# Altium project Gen_Ai_Kbd.PrjPcb (part 2 of 3)

## Sheet Lights.SchDoc
size 594 x 420 mm; SheetNumber: 4; SheetTotal: 11; SPICEModelCacheKKOZVZNQ: <root> / <DocumentId>KKOZVZNQ</DocumentId> / <CacheFrame Number="0"> / <Model Name="0402_885012205018_100nf" Kind="CKT"> / <Text>******* / .subckt 0402_885012205018_100nF 1 2 / Rser 1 3 0.0183525691398 / Lser 2 4 3.07541467E-10 / C1 3 4 0.0000001 / Rpar 3 4 5000000000 / .ends 0402_885012205018_100nF</Text> / </Model> / </CacheFrame> / </root>
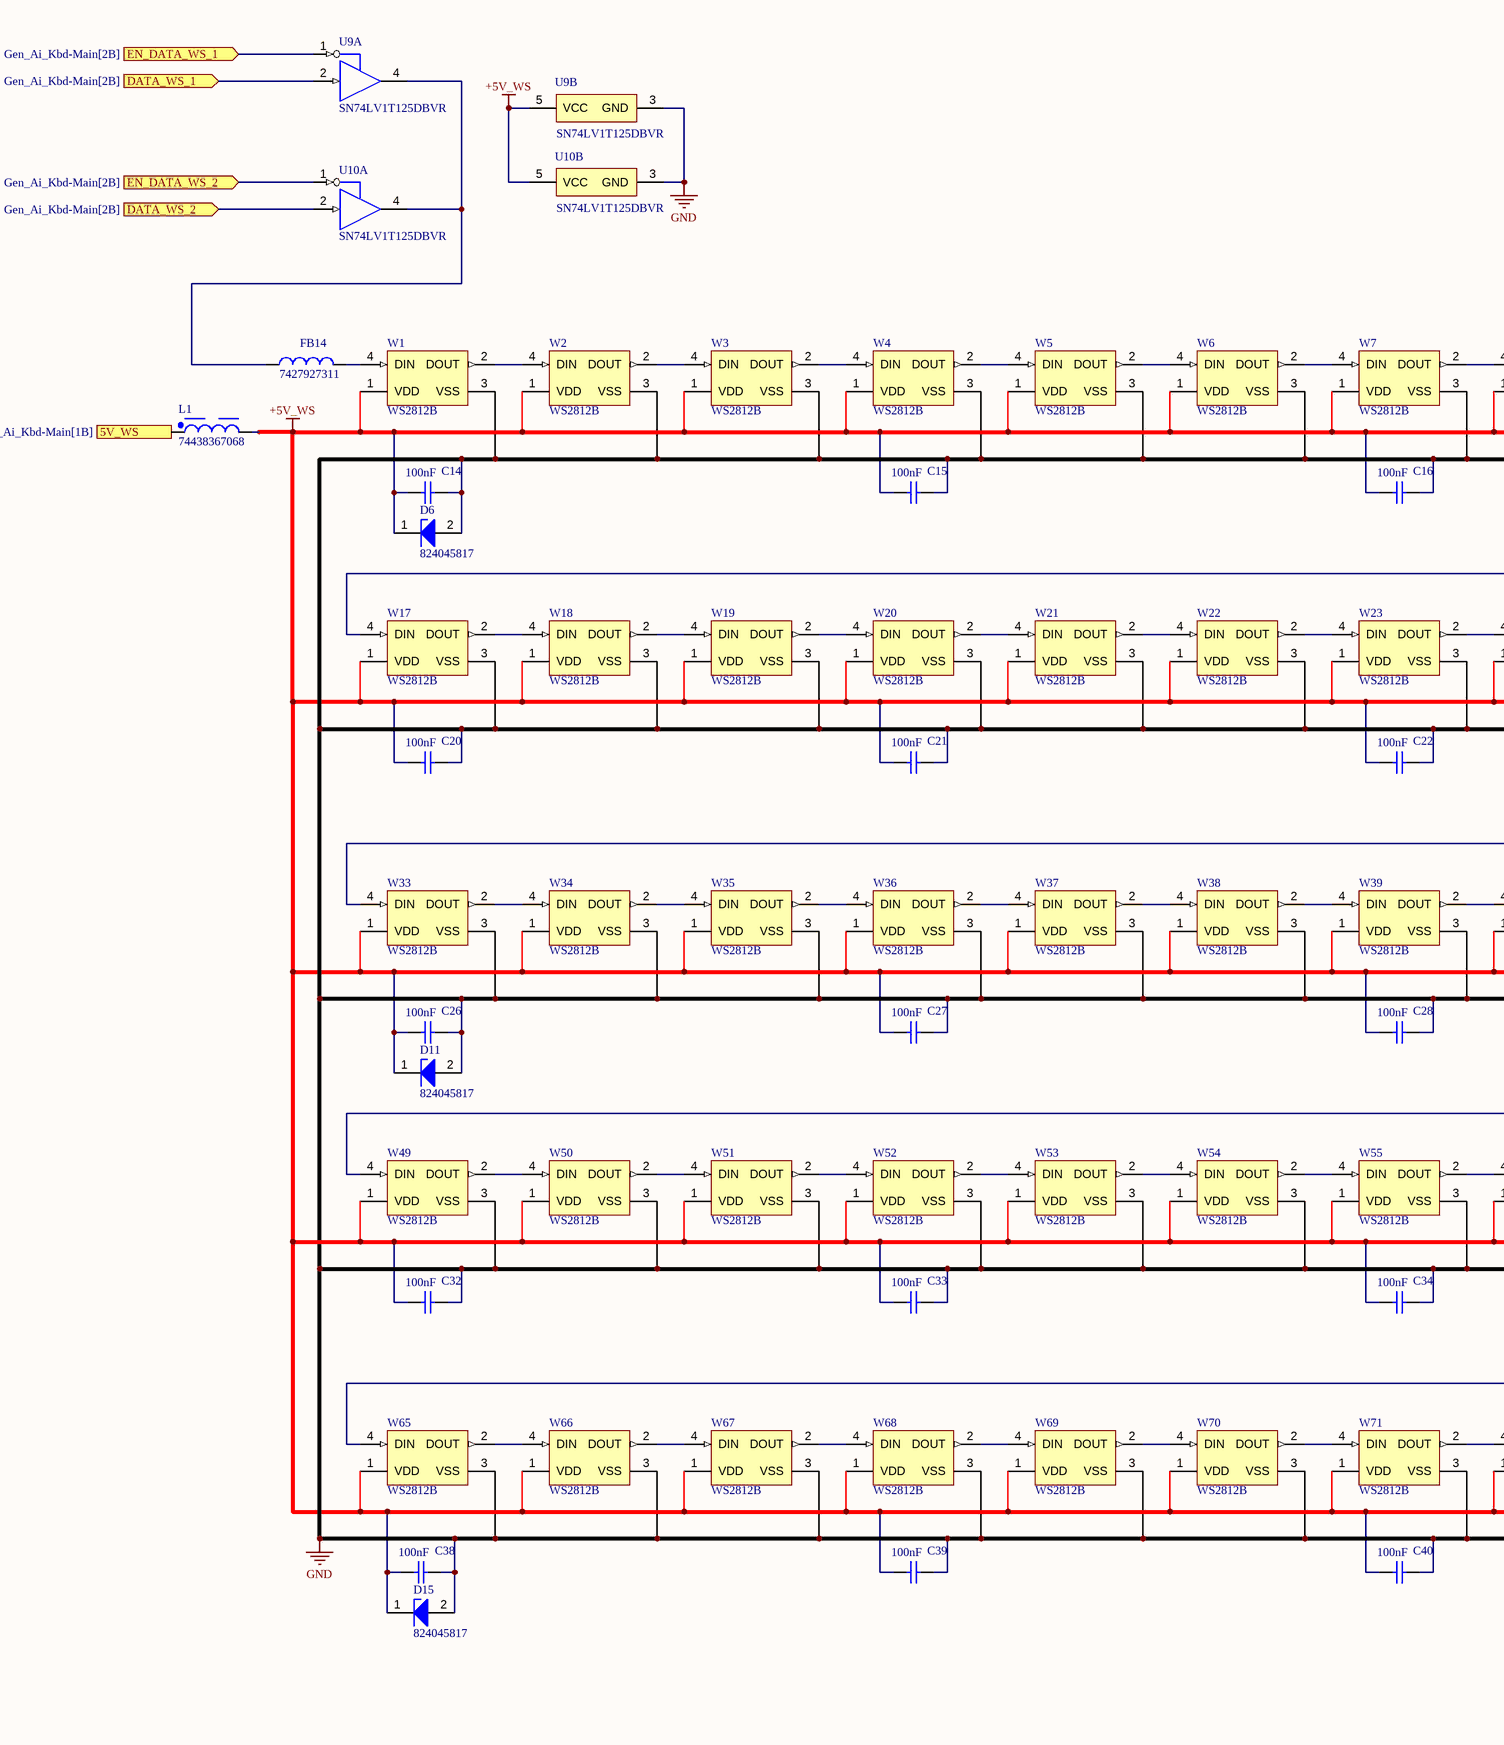
[diagram p4: Lights.SchDoc, left]
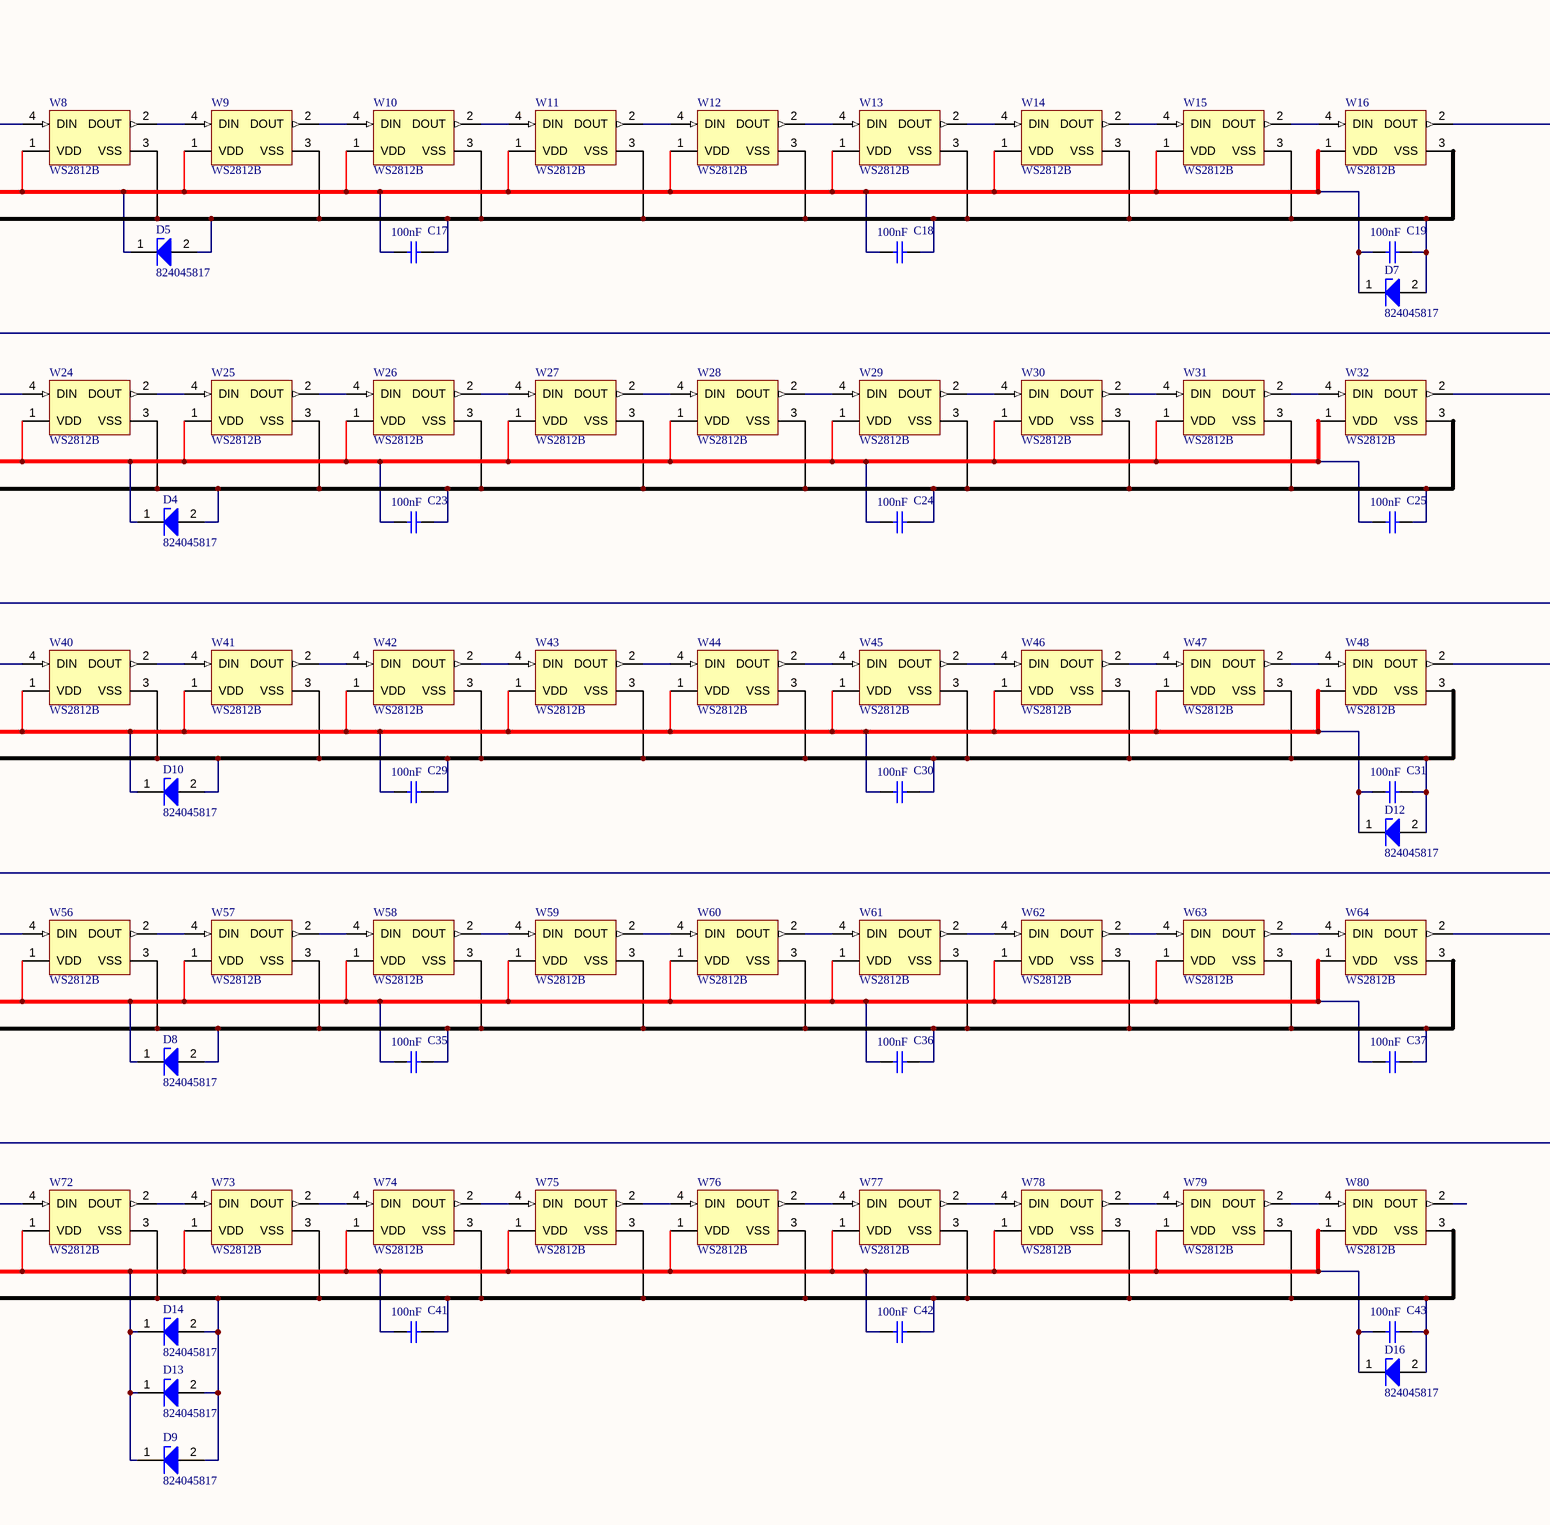
[diagram p5: Lights.SchDoc, right]

### Parts
C14  Capacitance: 100nF  [WCAP-CSGP_0402_L1W0.5H0.5]  (hidden comment: 885012205018)
C15  Capacitance: 100nF  [WCAP-CSGP_0402_L1W0.5H0.5]  (hidden comment: 885012205018)
C16  Capacitance: 100nF  [WCAP-CSGP_0402_L1W0.5H0.5]  (hidden comment: 885012205018)
C17  Capacitance: 100nF  [WCAP-CSGP_0402_L1W0.5H0.5]  (hidden comment: 885012205018)
C18  Capacitance: 100nF  [WCAP-CSGP_0402_L1W0.5H0.5]  (hidden comment: 885012205018)
C19  Capacitance: 100nF  [WCAP-CSGP_0402_L1W0.5H0.5]  (hidden comment: 885012205018)
C20  Capacitance: 100nF  [WCAP-CSGP_0402_L1W0.5H0.5]  (hidden comment: 885012205018)
C21  Capacitance: 100nF  [WCAP-CSGP_0402_L1W0.5H0.5]  (hidden comment: 885012205018)
C22  Capacitance: 100nF  [WCAP-CSGP_0402_L1W0.5H0.5]  (hidden comment: 885012205018)
C23  Capacitance: 100nF  [WCAP-CSGP_0402_L1W0.5H0.5]  (hidden comment: 885012205018)
C24  Capacitance: 100nF  [WCAP-CSGP_0402_L1W0.5H0.5]  (hidden comment: 885012205018)
C25  Capacitance: 100nF  [WCAP-CSGP_0402_L1W0.5H0.5]  (hidden comment: 885012205018)
C26  Capacitance: 100nF  [WCAP-CSGP_0402_L1W0.5H0.5]  (hidden comment: 885012205018)
C27  Capacitance: 100nF  [WCAP-CSGP_0402_L1W0.5H0.5]  (hidden comment: 885012205018)
C28  Capacitance: 100nF  [WCAP-CSGP_0402_L1W0.5H0.5]  (hidden comment: 885012205018)
C29  Capacitance: 100nF  [WCAP-CSGP_0402_L1W0.5H0.5]  (hidden comment: 885012205018)
C30  Capacitance: 100nF  [WCAP-CSGP_0402_L1W0.5H0.5]  (hidden comment: 885012205018)
C31  Capacitance: 100nF  [WCAP-CSGP_0402_L1W0.5H0.5]  (hidden comment: 885012205018)
C32  Capacitance: 100nF  [WCAP-CSGP_0402_L1W0.5H0.5]  (hidden comment: 885012205018)
C33  Capacitance: 100nF  [WCAP-CSGP_0402_L1W0.5H0.5]  (hidden comment: 885012205018)
C34  Capacitance: 100nF  [WCAP-CSGP_0402_L1W0.5H0.5]  (hidden comment: 885012205018)
C35  Capacitance: 100nF  [WCAP-CSGP_0402_L1W0.5H0.5]  (hidden comment: 885012205018)
C36  Capacitance: 100nF  [WCAP-CSGP_0402_L1W0.5H0.5]  (hidden comment: 885012205018)
C37  Capacitance: 100nF  [WCAP-CSGP_0402_L1W0.5H0.5]  (hidden comment: 885012205018)
C38  Capacitance: 100nF  [WCAP-CSGP_0402_L1W0.5H0.5]  (hidden comment: 885012205018)
C39  Capacitance: 100nF  [WCAP-CSGP_0402_L1W0.5H0.5]  (hidden comment: 885012205018)
C40  Capacitance: 100nF  [WCAP-CSGP_0402_L1W0.5H0.5]  (hidden comment: 885012205018)
C41  Capacitance: 100nF  [WCAP-CSGP_0402_L1W0.5H0.5]  (hidden comment: 885012205018)
C42  Capacitance: 100nF  [WCAP-CSGP_0402_L1W0.5H0.5]  (hidden comment: 885012205018)
C43  Capacitance: 100nF  [WCAP-CSGP_0402_L1W0.5H0.5]  (hidden comment: 885012205018)
D4  824045817  [WE-TVS_DFN1610-2L]
D5  824045817  [WE-TVS_DFN1610-2L]
D6  824045817  [WE-TVS_DFN1610-2L]
D7  824045817  [WE-TVS_DFN1610-2L]
D8  824045817  [WE-TVS_DFN1610-2L]
D9  824045817  [WE-TVS_DFN1610-2L]
D10  824045817  [WE-TVS_DFN1610-2L]
D11  824045817  [WE-TVS_DFN1610-2L]
D12  824045817  [WE-TVS_DFN1610-2L]
D13  824045817  [WE-TVS_DFN1610-2L]
D14  824045817  [WE-TVS_DFN1610-2L]
D15  824045817  [WE-TVS_DFN1610-2L]
D16  824045817  [WE-TVS_DFN1610-2L]
FB14  7427927311  [WE-CBF_0402_L1W0.5H0.5_HC]
L1  74438367068  [WE-MAPI_5030]
U9  SN74LV1T125DBVR  [DBV0005A_M]  (parts A,B of 2)
U10  SN74LV1T125DBVR  [DBV0005A_M]  (parts A,B of 2)
W1  WS2812B  [ADA-RGB-1655_V]
W2  WS2812B  [ADA-RGB-1655_V]
W3  WS2812B  [ADA-RGB-1655_V]
W4  WS2812B  [ADA-RGB-1655_V]
W5  WS2812B  [ADA-RGB-1655_V]
W6  WS2812B  [ADA-RGB-1655_V]
W7  WS2812B  [ADA-RGB-1655_V]
W8  WS2812B  [ADA-RGB-1655_V]
W9  WS2812B  [ADA-RGB-1655_V]
W10  WS2812B  [ADA-RGB-1655_V]
W11  WS2812B  [ADA-RGB-1655_V]
W12  WS2812B  [ADA-RGB-1655_V]
W13  WS2812B  [ADA-RGB-1655_V]
W14  WS2812B  [ADA-RGB-1655_V]
W15  WS2812B  [ADA-RGB-1655_V]
W16  WS2812B  [ADA-RGB-1655_V]
W17  WS2812B  [ADA-RGB-1655_V]
W18  WS2812B  [ADA-RGB-1655_V]
W19  WS2812B  [ADA-RGB-1655_V]
W20  WS2812B  [ADA-RGB-1655_V]
W21  WS2812B  [ADA-RGB-1655_V]
W22  WS2812B  [ADA-RGB-1655_V]
W23  WS2812B  [ADA-RGB-1655_V]
W24  WS2812B  [ADA-RGB-1655_V]
W25  WS2812B  [ADA-RGB-1655_V]
W26  WS2812B  [ADA-RGB-1655_V]
W27  WS2812B  [ADA-RGB-1655_V]
W28  WS2812B  [ADA-RGB-1655_V]
W29  WS2812B  [ADA-RGB-1655_V]
W30  WS2812B  [ADA-RGB-1655_V]
W31  WS2812B  [ADA-RGB-1655_V]
W32  WS2812B  [ADA-RGB-1655_V]
W33  WS2812B  [ADA-RGB-1655_V]
W34  WS2812B  [ADA-RGB-1655_V]
W35  WS2812B  [ADA-RGB-1655_V]
W36  WS2812B  [ADA-RGB-1655_V]
W37  WS2812B  [ADA-RGB-1655_V]
W38  WS2812B  [ADA-RGB-1655_V]
W39  WS2812B  [ADA-RGB-1655_V]
W40  WS2812B  [ADA-RGB-1655_V]
W41  WS2812B  [ADA-RGB-1655_V]
W42  WS2812B  [ADA-RGB-1655_V]
W43  WS2812B  [ADA-RGB-1655_V]
W44  WS2812B  [ADA-RGB-1655_V]
W45  WS2812B  [ADA-RGB-1655_V]
W46  WS2812B  [ADA-RGB-1655_V]
W47  WS2812B  [ADA-RGB-1655_V]
W48  WS2812B  [ADA-RGB-1655_V]
W49  WS2812B  [ADA-RGB-1655_V]
W50  WS2812B  [ADA-RGB-1655_V]
W51  WS2812B  [ADA-RGB-1655_V]
W52  WS2812B  [ADA-RGB-1655_V]
W53  WS2812B  [ADA-RGB-1655_V]
W54  WS2812B  [ADA-RGB-1655_V]
W55  WS2812B  [ADA-RGB-1655_V]
W56  WS2812B  [ADA-RGB-1655_V]
W57  WS2812B  [ADA-RGB-1655_V]
W58  WS2812B  [ADA-RGB-1655_V]
W59  WS2812B  [ADA-RGB-1655_V]
W60  WS2812B  [ADA-RGB-1655_V]
W61  WS2812B  [ADA-RGB-1655_V]
W62  WS2812B  [ADA-RGB-1655_V]
W63  WS2812B  [ADA-RGB-1655_V]
W64  WS2812B  [ADA-RGB-1655_V]
W65  WS2812B  [ADA-RGB-1655_V]
W66  WS2812B  [ADA-RGB-1655_V]
W67  WS2812B  [ADA-RGB-1655_V]
W68  WS2812B  [ADA-RGB-1655_V]
W69  WS2812B  [ADA-RGB-1655_V]
W70  WS2812B  [ADA-RGB-1655_V]
W71  WS2812B  [ADA-RGB-1655_V]
W72  WS2812B  [ADA-RGB-1655_V]
W73  WS2812B  [ADA-RGB-1655_V]
W74  WS2812B  [ADA-RGB-1655_V]
W75  WS2812B  [ADA-RGB-1655_V]
W76  WS2812B  [ADA-RGB-1655_V]
W77  WS2812B  [ADA-RGB-1655_V]
W78  WS2812B  [ADA-RGB-1655_V]
W79  WS2812B  [ADA-RGB-1655_V]
W80  WS2812B  [ADA-RGB-1655_V]

### Ports
5V_WS (in, see Gen_Ai_Kbd-Main[1B]), DATA_WS_1 (in, see Gen_Ai_Kbd-Main[2B]), DATA_WS_2 (in, see Gen_Ai_Kbd-Main[2B]), EN_DATA_WS_1 (in, see Gen_Ai_Kbd-Main[2B]), EN_DATA_WS_2 (in, see Gen_Ai_Kbd-Main[2B])

### Nets
+5V_GLOBAL_BUS: L1.1 ; port 5V_WS
+5V_WS: C14.1 C15.1 C16.1 C17.1 C18.1 C19.1 C20.1 C21.1 C22.1 C23.1 C24.1 C25.1 C26.1 C27.1 C28.1 C29.1 C30.1 C31.1 C32.1 C33.1 C34.1 C35.1 C36.1 C37.1 C38.1 C39.1 C40.1 C41.1 C42.1 C43.1 D4.1(I/O_1) D5.1(I/O_1) D6.1(I/O_1) D7.1(I/O_1) D8.1(I/O_1) D9.1(I/O_1) D10.1(I/O_1) D11.1(I/O_1) D12.1(I/O_1) D13.1(I/O_1) D14.1(I/O_1) D15.1(I/O_1) D16.1(I/O_1) L1.2 U9.5(VCC) U10.5(VCC) W1.1(VDD) W2.1(VDD) W3.1(VDD) W4.1(VDD) W5.1(VDD) W6.1(VDD) W7.1(VDD) W8.1(VDD) W9.1(VDD) W10.1(VDD) W11.1(VDD) W12.1(VDD) W13.1(VDD) W14.1(VDD) W15.1(VDD) W16.1(VDD) W17.1(VDD) W18.1(VDD) W19.1(VDD) W20.1(VDD) W21.1(VDD) W22.1(VDD) W23.1(VDD) W24.1(VDD) W25.1(VDD) W26.1(VDD) W27.1(VDD) W28.1(VDD) W29.1(VDD) W30.1(VDD) W31.1(VDD) W32.1(VDD) W33.1(VDD) W34.1(VDD) W35.1(VDD) W36.1(VDD) W37.1(VDD) W38.1(VDD) W39.1(VDD) W40.1(VDD) W41.1(VDD) W42.1(VDD) W43.1(VDD) W44.1(VDD) W45.1(VDD) W46.1(VDD) W47.1(VDD) W48.1(VDD) W49.1(VDD) W50.1(VDD) W51.1(VDD) W52.1(VDD) W53.1(VDD) W54.1(VDD) W55.1(VDD) W56.1(VDD) W57.1(VDD) W58.1(VDD) W59.1(VDD) W60.1(VDD) W61.1(VDD) W62.1(VDD) W63.1(VDD) W64.1(VDD) W65.1(VDD) W66.1(VDD) W67.1(VDD) W68.1(VDD) W69.1(VDD) W70.1(VDD) W71.1(VDD) W72.1(VDD) W73.1(VDD) W74.1(VDD) W75.1(VDD) W76.1(VDD) W77.1(VDD) W78.1(VDD) W79.1(VDD) W80.1(VDD)
GND: C14.2 C15.2 C16.2 C17.2 C18.2 C19.2 C20.2 C21.2 C22.2 C23.2 C24.2 C25.2 C26.2 C27.2 C28.2 C29.2 C30.2 C31.2 C32.2 C33.2 C34.2 C35.2 C36.2 C37.2 C38.2 C39.2 C40.2 C41.2 C42.2 C43.2 D4.2(GND) D5.2(GND) D6.2(GND) D7.2(GND) D8.2(GND) D9.2(GND) D10.2(GND) D11.2(GND) D12.2(GND) D13.2(GND) D14.2(GND) D15.2(GND) D16.2(GND) U9.3(GND) U10.3(GND) W1.3(VSS) W2.3(VSS) W3.3(VSS) W4.3(VSS) W5.3(VSS) W6.3(VSS) W7.3(VSS) W8.3(VSS) W9.3(VSS) W10.3(VSS) W11.3(VSS) W12.3(VSS) W13.3(VSS) W14.3(VSS) W15.3(VSS) W16.3(VSS) W17.3(VSS) W18.3(VSS) W19.3(VSS) W20.3(VSS) W21.3(VSS) W22.3(VSS) W23.3(VSS) W24.3(VSS) W25.3(VSS) W26.3(VSS) W27.3(VSS) W28.3(VSS) W29.3(VSS) W30.3(VSS) W31.3(VSS) W32.3(VSS) W33.3(VSS) W34.3(VSS) W35.3(VSS) W36.3(VSS) W37.3(VSS) W38.3(VSS) W39.3(VSS) W40.3(VSS) W41.3(VSS) W42.3(VSS) W43.3(VSS) W44.3(VSS) W45.3(VSS) W46.3(VSS) W47.3(VSS) W48.3(VSS) W49.3(VSS) W50.3(VSS) W51.3(VSS) W52.3(VSS) W53.3(VSS) W54.3(VSS) W55.3(VSS) W56.3(VSS) W57.3(VSS) W58.3(VSS) W59.3(VSS) W60.3(VSS) W61.3(VSS) W62.3(VSS) W63.3(VSS) W64.3(VSS) W65.3(VSS) W66.3(VSS) W67.3(VSS) W68.3(VSS) W69.3(VSS) W70.3(VSS) W71.3(VSS) W72.3(VSS) W73.3(VSS) W74.3(VSS) W75.3(VSS) W76.3(VSS) W77.3(VSS) W78.3(VSS) W79.3(VSS) W80.3(VSS)
PD3: U9.2(A) ; port DATA_WS_1
PG2: U9.1(~{OE}) ; port EN_DATA_WS_1
NetFB14_1: FB14.1 U9.4(Y) U10.4(Y)
NetFB14_2: FB14.2 W1.4(DIN)
NetMD1_16: U10.2(A) ; port DATA_WS_2
NetMD1_33: U10.1(~{OE}) ; port EN_DATA_WS_2
NetW1_2: W1.2(DOUT) W2.4(DIN)
NetW2_2: W2.2(DOUT) W3.4(DIN)
NetW3_2: W3.2(DOUT) W4.4(DIN)
NetW4_2: W4.2(DOUT) W5.4(DIN)
NetW5_2: W5.2(DOUT) W6.4(DIN)
NetW6_2: W6.2(DOUT) W7.4(DIN)
NetW7_2: W7.2(DOUT) W8.4(DIN)
NetW8_2: W8.2(DOUT) W9.4(DIN)
NetW9_2: W9.2(DOUT) W10.4(DIN)
NetW10_2: W10.2(DOUT) W11.4(DIN)
NetW11_2: W11.2(DOUT) W12.4(DIN)
NetW12_2: W12.2(DOUT) W13.4(DIN)
NetW13_2: W13.2(DOUT) W14.4(DIN)
NetW14_2: W14.2(DOUT) W15.4(DIN)
NetW15_2: W15.2(DOUT) W16.4(DIN)
NetW16_2: W16.2(DOUT) W17.4(DIN)
NetW17_2: W17.2(DOUT) W18.4(DIN)
NetW18_2: W18.2(DOUT) W19.4(DIN)
NetW19_2: W19.2(DOUT) W20.4(DIN)
NetW20_2: W20.2(DOUT) W21.4(DIN)
NetW21_2: W21.2(DOUT) W22.4(DIN)
NetW22_2: W22.2(DOUT) W23.4(DIN)
NetW23_2: W23.2(DOUT) W24.4(DIN)
NetW24_2: W24.2(DOUT) W25.4(DIN)
NetW25_2: W25.2(DOUT) W26.4(DIN)
NetW26_2: W26.2(DOUT) W27.4(DIN)
NetW27_2: W27.2(DOUT) W28.4(DIN)
NetW28_2: W28.2(DOUT) W29.4(DIN)
NetW29_2: W29.2(DOUT) W30.4(DIN)
NetW30_2: W30.2(DOUT) W31.4(DIN)
NetW31_2: W31.2(DOUT) W32.4(DIN)
NetW32_2: W32.2(DOUT) W33.4(DIN)
NetW33_2: W33.2(DOUT) W34.4(DIN)
NetW34_2: W34.2(DOUT) W35.4(DIN)
NetW35_2: W35.2(DOUT) W36.4(DIN)
NetW36_2: W36.2(DOUT) W37.4(DIN)
NetW37_2: W37.2(DOUT) W38.4(DIN)
NetW38_2: W38.2(DOUT) W39.4(DIN)
NetW39_2: W39.2(DOUT) W40.4(DIN)
NetW40_2: W40.2(DOUT) W41.4(DIN)
NetW41_2: W41.2(DOUT) W42.4(DIN)
NetW42_2: W42.2(DOUT) W43.4(DIN)
NetW43_2: W43.2(DOUT) W44.4(DIN)
NetW44_2: W44.2(DOUT) W45.4(DIN)
NetW45_2: W45.2(DOUT) W46.4(DIN)
NetW46_2: W46.2(DOUT) W47.4(DIN)
NetW47_2: W47.2(DOUT) W48.4(DIN)
NetW48_2: W48.2(DOUT) W49.4(DIN)
NetW49_2: W49.2(DOUT) W50.4(DIN)
NetW50_2: W50.2(DOUT) W51.4(DIN)
NetW51_2: W51.2(DOUT) W52.4(DIN)
NetW52_2: W52.2(DOUT) W53.4(DIN)
NetW53_2: W53.2(DOUT) W54.4(DIN)
NetW54_2: W54.2(DOUT) W55.4(DIN)
NetW55_2: W55.2(DOUT) W56.4(DIN)
NetW56_2: W56.2(DOUT) W57.4(DIN)
NetW57_2: W57.2(DOUT) W58.4(DIN)
NetW58_2: W58.2(DOUT) W59.4(DIN)
NetW59_2: W59.2(DOUT) W60.4(DIN)
NetW60_2: W60.2(DOUT) W61.4(DIN)
NetW61_2: W61.2(DOUT) W62.4(DIN)
NetW62_2: W62.2(DOUT) W63.4(DIN)
NetW63_2: W63.2(DOUT) W64.4(DIN)
NetW64_2: W64.2(DOUT) W65.4(DIN)
NetW65_2: W65.2(DOUT) W66.4(DIN)
NetW66_2: W66.2(DOUT) W67.4(DIN)
NetW67_2: W67.2(DOUT) W68.4(DIN)
NetW68_2: W68.2(DOUT) W69.4(DIN)
NetW69_2: W69.2(DOUT) W70.4(DIN)
NetW70_2: W70.2(DOUT) W71.4(DIN)
NetW71_2: W71.2(DOUT) W72.4(DIN)
NetW72_2: W72.2(DOUT) W73.4(DIN)
NetW73_2: W73.2(DOUT) W74.4(DIN)
NetW74_2: W74.2(DOUT) W75.4(DIN)
NetW75_2: W75.2(DOUT) W76.4(DIN)
NetW76_2: W76.2(DOUT) W77.4(DIN)
NetW77_2: W77.2(DOUT) W78.4(DIN)
NetW78_2: W78.2(DOUT) W79.4(DIN)
NetW79_2: W79.2(DOUT) W80.4(DIN)

Not connected (* = marked no-connect by the designer): W80 2(DOUT)

### Notes on the sheet
- DWG NO:
- REV:
- REVISION
- DESCRIPTION
- DATE
- APPROVED
- PROJECT
- sumasta
- t
- PROJECT REVISION:
- TITLE
- DOCUMENT REVISION:
- DESIGN ITEM:
- SCALE:
- A2
- SIZE
- CAGE CODE
- FILE NAME
- DWG NO.
- SHEET
- OF
- REV

### Library data of the parts
C14-C43 = CMP-007-000501-1: WCAP-CSGP Multilayer Ceramic Chip Capacitor, General Purpose, size 0402, X7R, 100nF, 10VDC; Manufacturer: Wurth Elektronik; Case/Size Code: 0402; Rated Voltage (DC): 10V; Capacitance Tolerance: +/-10%; Insulation Resistance: 5GO; Technical Reference: X7R0402104K010DFCT10000; Dissipation Factor: 5%; ComponentLink2Description: Datasheet Link; Operating Temperature Min: -55°C; ComponentLink1URL: https://www.we-online.com/redexpert/article/885012205018?ad; Pin Count: 2; Component Type: Standard; Manufacturer Part Number: 885012205018; Category: Multilayer Ceramic Chip Capacitors; Height: 0.5mm; Ceramic Type: X7R; ComponentLink2URL: https://www.we-online.com/redexpert/spec/885012205018?ad; Packaging: Tape and Reel; ComponentLink1Description: Website Link; Length: 1mm; Design Item ID: 885012205018; Source: WCAP-CSGP.SchLib; Match Code: WCAP-CSGP; Operating Temperature Max: 125°C; Mount: Surface Mount; Width: 0.5mm
D4-D16 = CMP-03913-128281014-1: 824045817 Tvs Diode, Unidir, 7V, Dfn1610 Rohs Compliant: Yes; Leakage Current: 1µA; Forward Voltage: 800mV; Min Operating Temperature: -55°C; Width: 1mm; RoHS: Compliant; Length: 1.6mm; Max Operating Temperature: 85°C; NexarPartId: 128281014; Height: 500µm
FB14 = CMP-0220-00132-2: NexarPartId: 19122429; Max Current Rating: 1.2A; Impedance: 120Ω; Number of Lines: 1; Tolerance: 25%; DC Resistance (DCR): 90mΩ; Test Frequency: 100MHz; Height: 500µm; Material: Ferrite; Width: 500µm; Mount: Surface Mount; Case/Package: SMD/SMT; Max Operating Temperature: 125°C; Current Rating: 1.2A; Case Code (Imperial): 0402; RoHS: Compliant; REACH SVHC: Unknown; Depth: 500µm; Max DC Current: 1.2A; Case Code (Metric): 1005; Length: 1mm; Termination: SMD/SMT; Packaging: Digi-Reel®; Lead Free: Lead Free; Min Operating Temperature: -55°C
L1 = CMP-03913-130924347-1: 74438367068 Power Inductor, 6.8Uh, Shielded, 5.7A Rohs Compliant: Yes; Inductance: 6.8µH; DC Resistance (DCR): 42mΩ; Current Rating: 4.3A; Min Operating Temperature: -40°C; Ambient Temperature Range High: 85°C; NexarPartId: 130924347; Width: 5.4mm; Ambient Temperature Range Low: -40°C; RoHS: Compliant; Height: 3.1mm; Length: 5.4mm; Max Operating Temperature: 125°C
U9 U10 = CMP-0859-00122-3: Single Power Supply, Single BUFFER GATE w/ 3-State Output (active low enable), DBV0005A, LARGE T&R; Manufacturer: Texas Instruments; Schmitt Trigger: No; Sub-Family: Non-Inverting Buffer/Driver; Voltage(Nom)(V): 1.8,2.5,3.3,5.5; Output Drive (IOL/IOH)(Max)(mA): 8/-8; Bits(#): 1; Technology Family: LV1T; F @ Nom Voltage(Max)(Mhz): 50; Output Type: CMOS; Input Type: TTL; VCC(Min)(V): 1.6; tpd @ Nom Voltage(Max)(ns): 14.5,9.5,8.0,6.5; 3-State Output: Yes; ICC @ Nom Voltage(Max)(mA): 0.01; Rating: Catalog; Logic: True; Special Features: 1.8V to 3.3V Up Translation,3.3V to 1.8V Down Translation,5V Input Tolerant; VCC(Max)(V): 5.5; PackageReference: DBV0005A; Generic Part Number: SN74LV1T125; Operating Temperature Range(C): -40 to 125; DatasheetVersion: SCLS745A
W1-W80 = CMP-00026-00001-1: NeoPixel 5050 RGB LED with Integrated Driver Chip - 10 Pack

## Sheet Display.SchDoc
size 420 x 297 mm; SheetNumber: 5; SheetTotal: 11; SPICEModelCacheWZVAXILY: <root> / <DocumentId>WZVAXILY</DocumentId> / <CacheFrame Number="0"> / <Model Name="0603_885012206095_100nf" Kind="CKT"> / <Text>******* / .subckt 0603_885012206095_100nF 1 2 / Rser 1 3 0.0157659152881 / Lser 2 4 3.10171966E-10 / C1 3 4 0.0000001 / Rpar 3 4 5000000000 / .ends 0603_885012206095_100nF</Text> / </Model> / <Model Name="0603_885012106006_10uf" Kind="CKT"> / <Text>******* / .subckt 0603_885012106006_10uF 1 2 / Rser 1 3 0.00407641026021 / Lser 2 4 4.16060333E-10 / C1 3 4 0.00001 / Rpar 3 4 5000000 / .ends 0603_885012106006_10uF</Text> / </Model> / </CacheFrame> / </root>
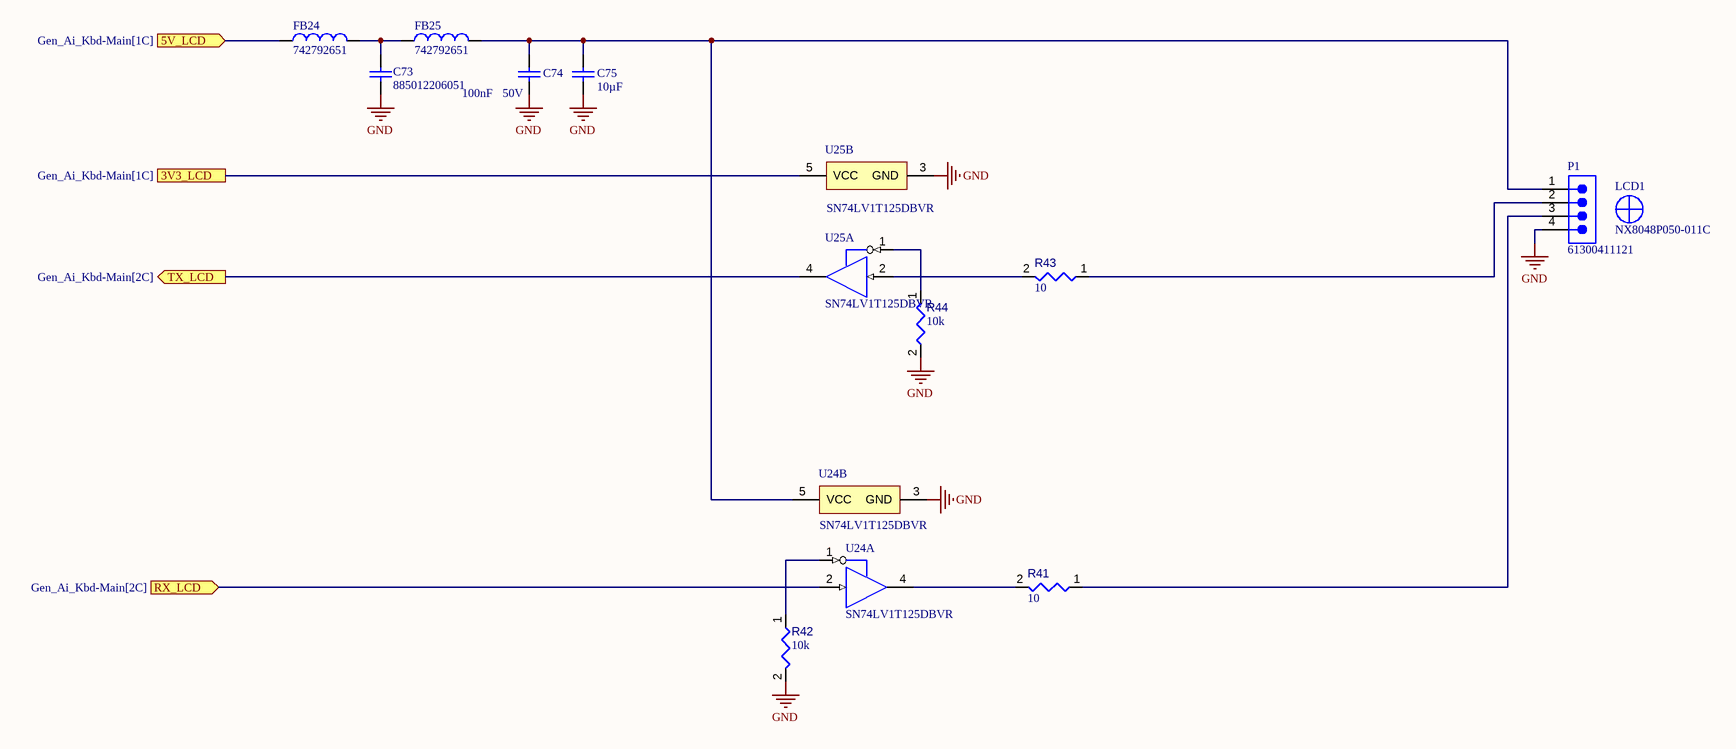
[diagram p6: Display.SchDoc]

### Parts
C73  885012206051  [WCAP-CSGP_0603_L1.6W0.8H0.8_Reflow]
C74  Capacitance: 100nF  Rated Voltage (DC): 50V  [WCAP-CSGP_0603_L1.6W0.8H0.8_Reflow]  (hidden comment: 885012206095)
C75  Capacitance: 10µF  [WCAP-CSGP_0603_L1.6W0.8H0.8_Reflow]  (hidden comment: 885012106006)
FB24  742792651  [WE-CBF_0603_L1.6W0.8H0.8_HC]
FB25  742792651  [WE-CBF_0603_L1.6W0.8H0.8_HC]
LCD1  NX8048P050-011C  [NEXTION 5.5Inch]
P1  61300411121  [61300411121]
R41  value 10  [RESC1608X55X25ML10T15]  (hidden comment: Resistor 10k +/-1% 0603 100 mW)
R42  value 10k  [RESC1608X55X25ML10T15]  (hidden comment: Resistor 10k +/-1% 0603 100 mW)
R43  value 10  [RESC1608X55X25ML10T15]  (hidden comment: Resistor 10k +/-1% 0603 100 mW)
R44  value 10k  [RESC1608X55X25ML10T15]  (hidden comment: Resistor 10k +/-1% 0603 100 mW)
U24  SN74LV1T125DBVR  [DBV0005A_M]  (parts A,B of 2)
U25  SN74LV1T125DBVR  [DBV0005A_M]  (parts A,B of 2)

### Ports
3V3_LCD (see Gen_Ai_Kbd-Main[1C]), 5V_LCD (in, see Gen_Ai_Kbd-Main[1C]), RX_LCD (in, see Gen_Ai_Kbd-Main[2C]), TX_LCD (out, see Gen_Ai_Kbd-Main[2C])

### Nets
+3V3_GLOBAL_BUS: U25.5(VCC) ; port 3V3_LCD
+5V_GLOBAL_BUS: FB24.1 ; port 5V_LCD
GND: C73.1 C74.1 C75.1 P1.4 R42.2 R44.2 U24.3(GND) U25.3(GND)
PG9: U25.4(Y) ; port TX_LCD
PG14: U24.2(A) ; port RX_LCD
NetC73_2: C73.2 FB24.2 FB25.1
NetC74_2: C74.2 C75.2 FB25.2 P1.1 U24.5(VCC)
NetP1_2: P1.2 R43.1
NetP1_3: P1.3 R41.1
NetR41_2: R41.2 U24.4(Y)
NetR42_1: R42.1 U24.1(~{OE})
NetR43_2: R43.2 U25.2(A)
NetR44_1: R44.1 U25.1(~{OE})

Not connected (* = marked no-connect by the designer): LCD1 1

### Notes on the sheet
- THIS DOCUMENT AND THE DATA DISCLOSED HEREIN OR
- HEREWITH IS THE PROPERTY OF SUMASTA TECH AND MAY
- DWG NO:
- REVISION
- REV:
- DESCRIPTION
- DATE
- APPROVED
- BE FREELY DISTRIBUTED IN WHOLE. NO RIGHTS ARE
- THIS DOCUMENT IS SUBJECT TO CHANGE WITHOUT NOTICE
- RESERVED OR EXPRESS OR IMPLIED WARANTEE GIVEN.
- PROJECT
- sumasta
- t
- PROJECT REVISION:
- TITLE
- DOCUMENT REVISION:
- DESIGN ITEM:
- SCALE:
- A3
- SIZE
- CAGE CODE
- FILE NAME
- DWG NO.
- SHEET
- OF
- REV

### Library data of the parts
C73 = CMP-03913-53914760-1: 885012206051 Cap Cer 0.68UF 16V X7R 0603; Insulation Resistance: 700MΩ; Tolerance: 10%; Capacitance: 680nF; NexarPartId: 53914760; Dielectric: X7R; Max Operating Temperature: 125°C; Thickness: 939.8µm; Case Code (Imperial): 0603; Length: 1.6mm; RoHS: Compliant; Min Operating Temperature: -55°C; Width: 800µm; Mount: Surface Mount; Height: 800µm; Case/Package: 0603; Case Code (Metric): 1608; Voltage Rating (DC): 16V; Packaging: Tape & Reel (TR); Voltage Rating: 16V
C74 = CMP-007-000655-1: as C5 on sheet PoE; Operating Temperature Max: 125°C; Category: Multilayer Ceramic Chip Capacitors; ComponentLink1Description: Website Link; Manufacturer Part Number: 885012206095; Pin Count: 2; Ceramic Type: X7R; Component Type: Standard; Mount: Surface Mount; Operating Temperature Min: -55°C; Source: WCAP-CSGP.SchLib; ComponentLink2URL: https://www.we-online.com/redexpert/spec/885012206095?ad; Packaging: Tape and Reel; Match Code: WCAP-CSGP; Width: 0.8mm; ComponentLink1URL: https://www.we-online.com/redexpert/article/885012206095?ad; Height: 0.8mm; Design Item ID: 885012206095; Length: 1.6mm; ComponentLink2Description: Datasheet Link
C75 = CMP-007-000403-1: as C82 on sheet PoE; Mount: Surface Mount; Packaging: Tape and Reel; ComponentLink1URL: https://www.we-online.com/redexpert/article/885012106006?ad; Height: 0.8mm; ComponentLink2URL: https://www.we-online.com/redexpert/spec/885012106006?ad; Category: Multilayer Ceramic Chip Capacitors; Operating Temperature Max: 85°C; Operating Temperature Min: -55°C; Source: WCAP-CSGP.SchLib; Match Code: WCAP-CSGP; Design Item ID: 885012106006; Ceramic Type: X5R; Manufacturer Part Number: 885012106006; Component Type: Standard; Pin Count: 2; Width: 0.8mm; ComponentLink2Description: Datasheet Link; ComponentLink1Description: Website Link; Length: 1.6mm
FB24 FB25 = CMP-0220-00181-3: NexarPartId: 7864500; RMS Current (Irms): 1A; Number of Lines: 1; Test Frequency: 100MHz; Impedance: 600Ω; Inductance: 360mH; Resistance: 200mΩ; Tolerance: 25%; Case Code (Imperial): 0603; Lead Free: Lead Free; Current Rating: 1A; Height: 800µm; Min Operating Temperature: -55°C; Core Material: Ferrite; REACH SVHC: Unknown; Case/Package: 0603; Weight: 3.997283mg; Mount: Surface Mount; Termination: SMD/SMT; Case Code (Metric): 1608; DC Resistance (DCR): 200mΩ; Series Resistance: 200mΩ; Max Operating Temperature: 125°C; Width: 800µm; Length: 1.6mm; Max DC Current: 1A; RoHS: Compliant; Material: Ferrite; Max Current Rating: 1A; Depth: 800µm; Packaging: Cut Tape (CT)
LCD1 = CMP-00028-00007-2: Nextion 5.5 Inch LCD
P1 = CMP-1502-01064-2: NexarPartId: 32855522; Pitch: 2.54mm; Number of Contacts: 4; Contact Resistance: 20mΩ; Gender: Male; Current Rating: 3A; Connector Type: Male Pin; Voltage Rating: 250V; Lead Free: Lead Free; Contact Plating: Gold; Max Operating Temperature: 105°C; Packaging: Bulk; Height: 8.89mm; Orientation: Vertical; Contact Mating Length: 5.9944mm; Contact Material: Copper; Lead Pitch: 2.54mm; Min Operating Temperature: -40°C; Termination: Solder; Color: Black; Number of Rows: 1; REACH SVHC: Unknown; RoHS: Compliant; Mount: Through Hole; Number of Positions: 4; Number of Pins: 4; Operating Supply Voltage: 250V
R41-R44 = CMP-009-00017-5: as R47 on sheet keyboard-Left; RoHS Compliant: True; Min Operating Temperature: -55°C; Pins: 2; Case/Package: 0603; Mounting Technology: SM; Max Operating Temperature: 155°C; Tolerance: 1%
U24 U25 = CMP-0859-00122-3: as U9 on sheet Lights; PackageReference: DBV0005A; Generic Part Number: SN74LV1T125; Operating Temperature Range(C): -40 to 125; DatasheetVersion: SCLS745A

## Sheet Peripherals.SchDoc
size 420 x 297 mm; SheetNumber: 6; SheetTotal: 11; SPICEModelCacheINPTFRLM: <root> / <DocumentId>INPTFRLM</DocumentId> / <CacheFrame Number="0"> / <Model Name="0603_885012206095_100nf" Kind="CKT"> / <Text>******* / .subckt 0603_885012206095_100nF 1 2 / Rser 1 3 0.0157659152881 / Lser 2 4 3.10171966E-10 / C1 3 4 0.0000001 / Rpar 3 4 5000000000 / .ends 0603_885012206095_100nF</Text> / </Model> / <Model Name="0603_885012106006_10uf" Kind="CKT"> / <Text>******* / .subckt 0603_885012106006_10uF 1 2 / Rser 1 3 0.00407641026021 / Lser 2 4 4.16060333E-10 / C1 3 4 0.00001 / Rpar 3 4 5000000 / .ends 0603_885012106006_10uF</Text> / </Model> / </CacheFrame> / </root>
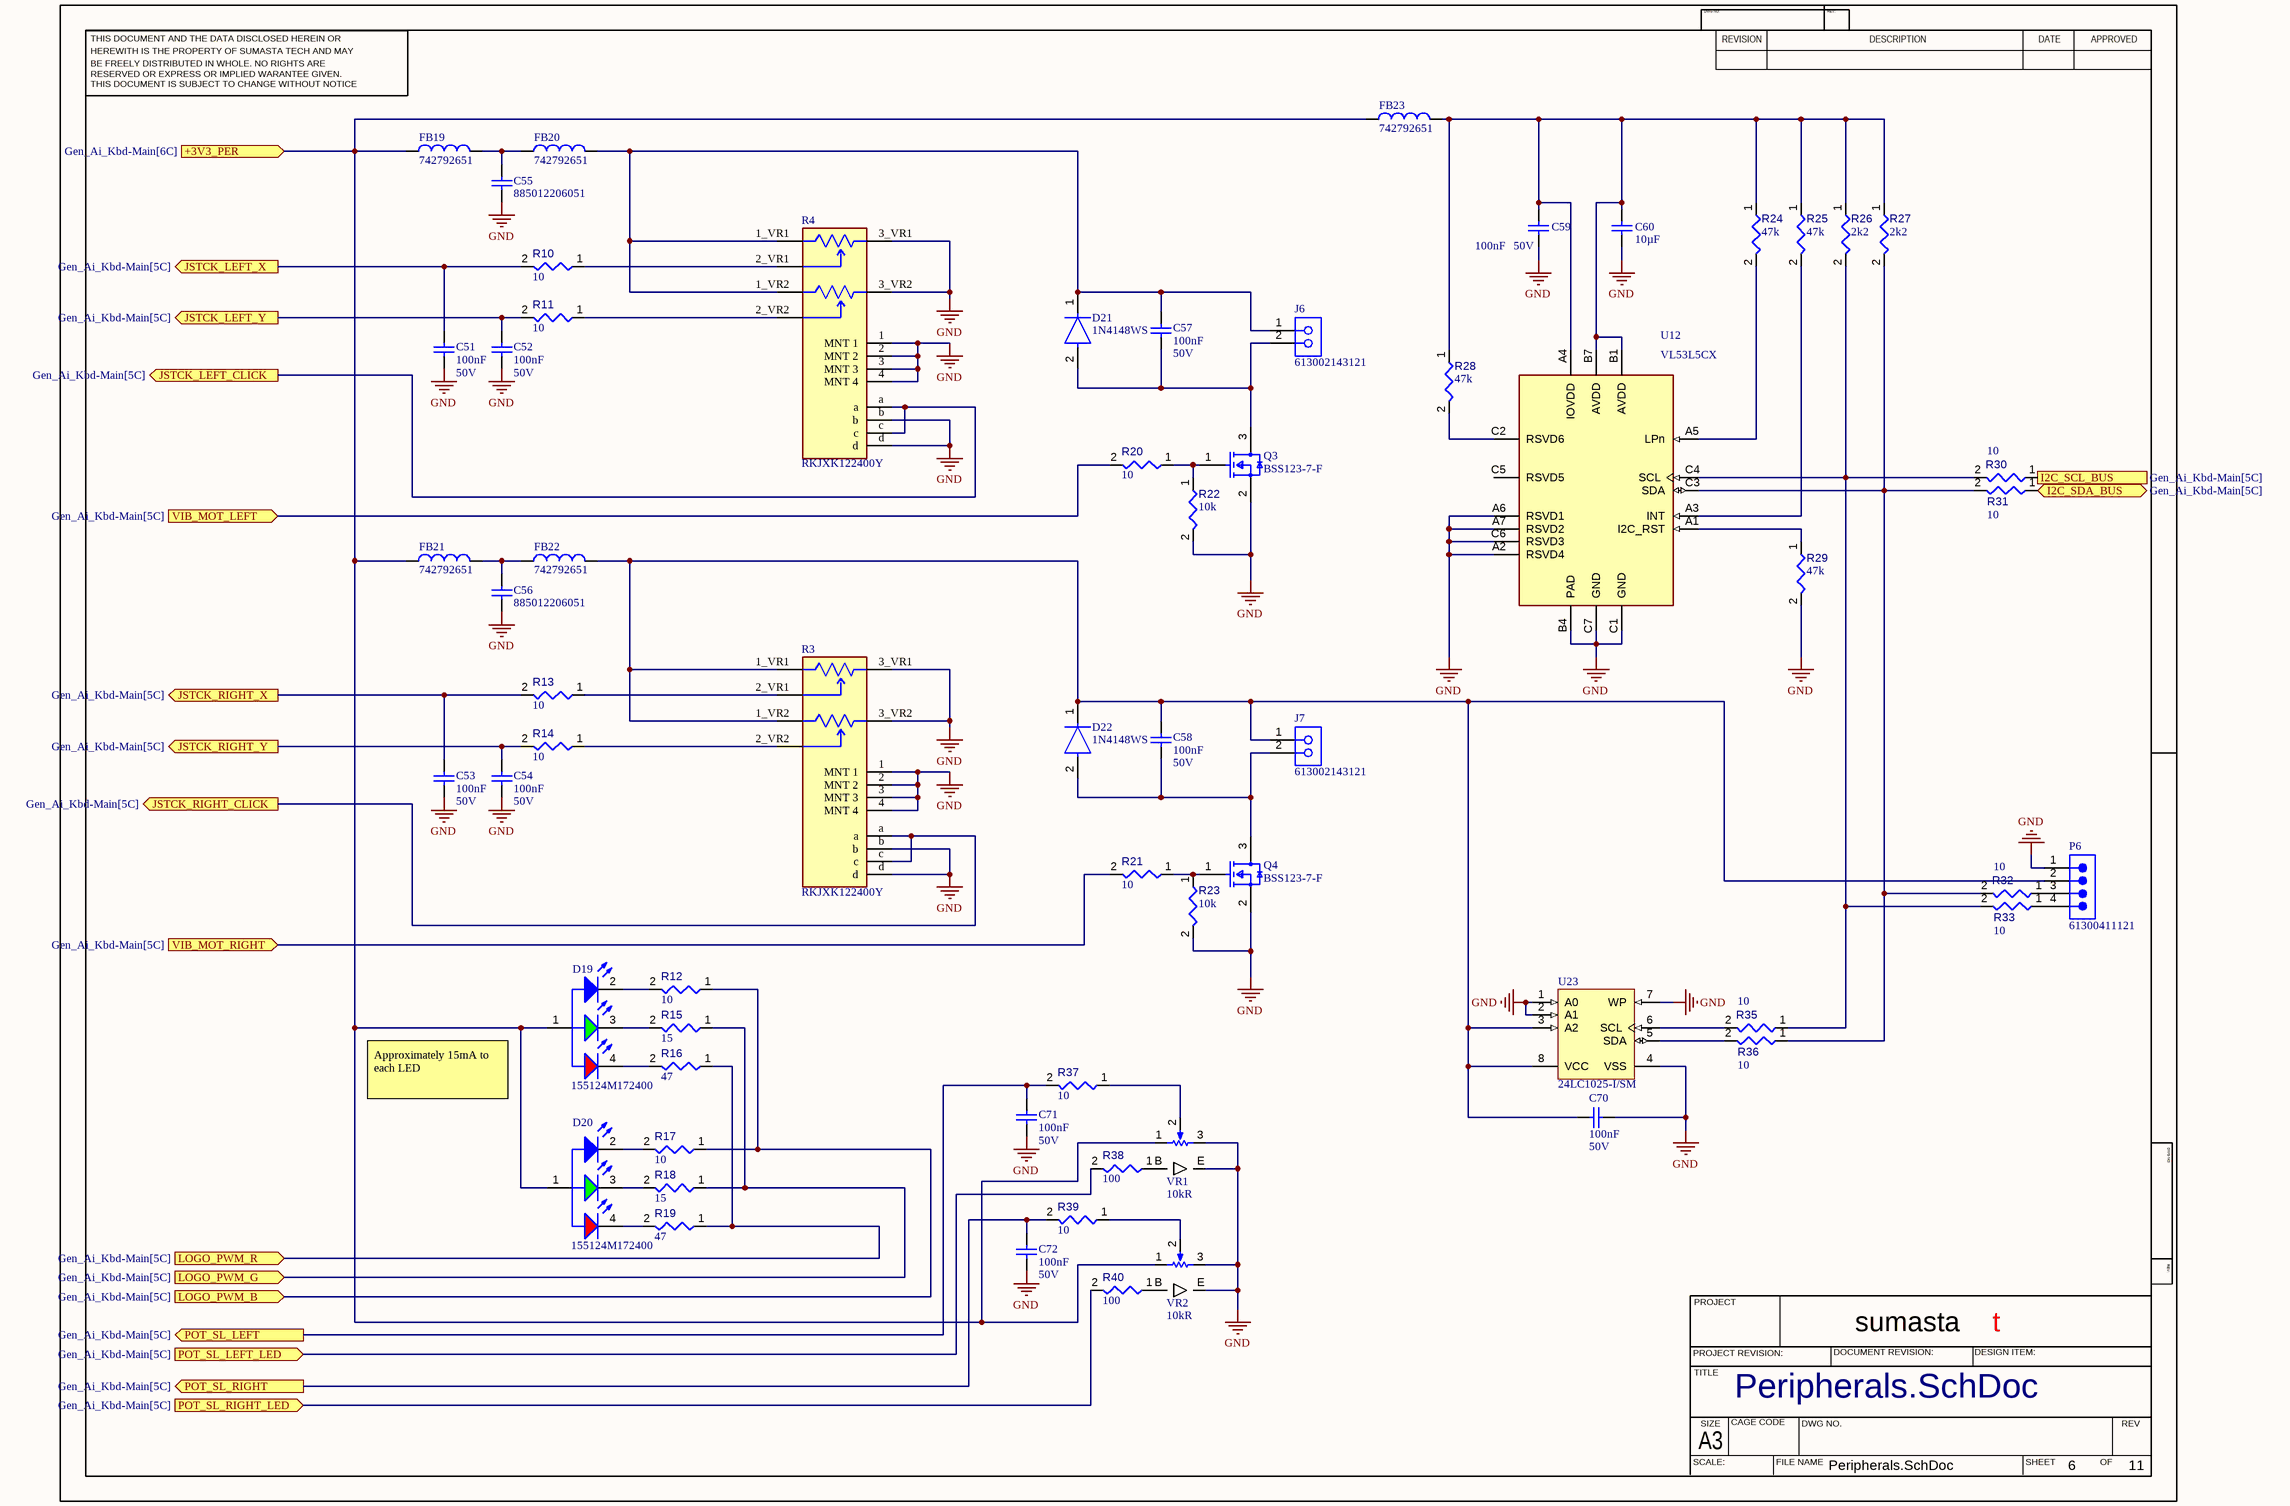
[diagram p7: Peripherals.SchDoc]

### Parts
C51  Capacitance: 100nF  Rated Voltage (DC): 50V  [WCAP-CSGP_0603_L1.6W0.8H0.8_Reflow]  (hidden comment: 885012206095)
C52  Capacitance: 100nF  Rated Voltage (DC): 50V  [WCAP-CSGP_0603_L1.6W0.8H0.8_Reflow]  (hidden comment: 885012206095)
C53  Capacitance: 100nF  Rated Voltage (DC): 50V  [WCAP-CSGP_0603_L1.6W0.8H0.8_Reflow]  (hidden comment: 885012206095)
C54  Capacitance: 100nF  Rated Voltage (DC): 50V  [WCAP-CSGP_0603_L1.6W0.8H0.8_Reflow]  (hidden comment: 885012206095)
C55  885012206051  [WCAP-CSGP_0603_L1.6W0.8H0.8_Reflow]
C56  885012206051  [WCAP-CSGP_0603_L1.6W0.8H0.8_Reflow]
C57  Capacitance: 100nF  Rated Voltage (DC): 50V  [WCAP-CSGP_0603_L1.6W0.8H0.8_Reflow]  (hidden comment: 885012206095)
C58  Capacitance: 100nF  Rated Voltage (DC): 50V  [WCAP-CSGP_0603_L1.6W0.8H0.8_Reflow]  (hidden comment: 885012206095)
C59  Capacitance: 100nF  Rated Voltage (DC): 50V  [WCAP-CSGP_0603_L1.6W0.8H0.8_Reflow]  (hidden comment: 885012206095)
C60  Capacitance: 10µF  [WCAP-CSGP_0603_L1.6W0.8H0.8_Reflow]  (hidden comment: 885012106006)
C70  Capacitance: 100nF  Rated Voltage (DC): 50V  [WCAP-CSGP_0603_L1.6W0.8H0.8_Reflow]  (hidden comment: 885012206095)
C71  Capacitance: 100nF  Rated Voltage (DC): 50V  [WCAP-CSGP_0603_L1.6W0.8H0.8_Reflow]  (hidden comment: 885012206095)
C72  Capacitance: 100nF  Rated Voltage (DC): 50V  [WCAP-CSGP_0603_L1.6W0.8H0.8_Reflow]  (hidden comment: 885012206095)
D19  155124M172400  [WL-SFSW_1204_155124M172400]
D20  155124M172400  [WL-SFSW_1204_155124M172400]
D21  1N4148WS  [FP-477AB-IPC_C]
D22  1N4148WS  [FP-477AB-IPC_C]
FB19  742792651  [WE-CBF_0603_L1.6W0.8H0.8_HC]
FB20  742792651  [WE-CBF_0603_L1.6W0.8H0.8_HC]
FB21  742792651  [WE-CBF_0603_L1.6W0.8H0.8_HC]
FB22  742792651  [WE-CBF_0603_L1.6W0.8H0.8_HC]
FB23  742792651  [WE-CBF_0603_L1.6W0.8H0.8_HC]
J6  613002143121  [613002143121]
J7  613002143121  [613002143121]
P6  61300411121  [61300411121]
Q3  BSS123-7-F  [FP-SOT23-MFG]
Q4  BSS123-7-F  [FP-SOT23-MFG]
R3  RKJXK122400Y  [FP-RKJXK122400Y-MFG]
R4  RKJXK122400Y  [FP-RKJXK122400Y-MFG]
R10  value 10  [RESC1608X55X25ML10T15]  (hidden comment: Resistor 10k +/-1% 0603 100 mW)
R11  value 10  [RESC1608X55X25ML10T15]  (hidden comment: Resistor 10k +/-1% 0603 100 mW)
R12  value 10  [RESC1608X55X25ML10T15]  (hidden comment: Resistor 10k +/-1% 0603 100 mW)
R13  value 10  [RESC1608X55X25ML10T15]  (hidden comment: Resistor 10k +/-1% 0603 100 mW)
R14  value 10  [RESC1608X55X25ML10T15]  (hidden comment: Resistor 10k +/-1% 0603 100 mW)
R15  value 15  [RESC1608X55X25ML10T15]  (hidden comment: Resistor 10k +/-1% 0603 100 mW)
R16  value 47  [RESC1608X55X25ML10T15]  (hidden comment: Resistor 10k +/-1% 0603 100 mW)
R17  value 10  [RESC1608X55X25ML10T15]  (hidden comment: Resistor 10k +/-1% 0603 100 mW)
R18  value 15  [RESC1608X55X25ML10T15]  (hidden comment: Resistor 10k +/-1% 0603 100 mW)
R19  value 47  [RESC1608X55X25ML10T15]  (hidden comment: Resistor 10k +/-1% 0603 100 mW)
R20  value 10  [RESC1608X55X25ML10T15]  (hidden comment: Resistor 10k +/-1% 0603 100 mW)
R21  value 10  [RESC1608X55X25ML10T15]  (hidden comment: Resistor 10k +/-1% 0603 100 mW)
R22  value 10k  [RESC1608X55X25ML10T15]  (hidden comment: Resistor 10k +/-1% 0603 100 mW)
R23  value 10k  [RESC1608X55X25ML10T15]  (hidden comment: Resistor 10k +/-1% 0603 100 mW)
R24  value 47k  [RESC1608X55X25ML10T15]  (hidden comment: Resistor 10k +/-1% 0603 100 mW)
R25  value 47k  [RESC1608X55X25ML10T15]  (hidden comment: Resistor 10k +/-1% 0603 100 mW)
R26  value 2k2  [RESC1608X55X25ML10T15]  (hidden comment: Resistor 10k +/-1% 0603 100 mW)
R27  value 2k2  [RESC1608X55X25ML10T15]  (hidden comment: Resistor 10k +/-1% 0603 100 mW)
R28  value 47k  [RESC1608X55X25ML10T15]  (hidden comment: Resistor 10k +/-1% 0603 100 mW)
R29  value 47k  [RESC1608X55X25ML10T15]  (hidden comment: Resistor 10k +/-1% 0603 100 mW)
R30  value 10  [RESC1608X55X25ML10T15]  (hidden comment: Resistor 10k +/-1% 0603 100 mW)
R31  value 10  [RESC1608X55X25ML10T15]  (hidden comment: Resistor 10k +/-1% 0603 100 mW)
R32  value 10  [RESC1608X55X25ML10T15]  (hidden comment: Resistor 10k +/-1% 0603 100 mW)
R33  value 10  [RESC1608X55X25ML10T15]  (hidden comment: Resistor 10k +/-1% 0603 100 mW)
R35  value 10  [RESC1608X55X25ML10T15]  (hidden comment: Resistor 10k +/-1% 0603 100 mW)
R36  value 10  [RESC1608X55X25ML10T15]  (hidden comment: Resistor 10k +/-1% 0603 100 mW)
R37  value 10  [RESC1608X55X25ML10T15]  (hidden comment: Resistor 10k +/-1% 0603 100 mW)
R38  value 100  [RESC1608X55X25ML10T15]  (hidden comment: Resistor 10k +/-1% 0603 100 mW)
R39  value 10  [RESC1608X55X25ML10T15]  (hidden comment: Resistor 10k +/-1% 0603 100 mW)
R40  value 100  [RESC1608X55X25ML10T15]  (hidden comment: Resistor 10k +/-1% 0603 100 mW)
U12  VL53L5CX  [VL53L5CX]
U23  24LC1025-I/SM  [SOIJ-SM8_L]
VR1  value 10kR  [PTL30-15R0]  (hidden comment: PTL30-15R0-103B1)
VR2  value 10kR  [PTL30-15R0]  (hidden comment: PTL30-15R0-103B1)

### Ports
+3V3_PER (in, see Gen_Ai_Kbd-Main[6C]), I2C_SCL_BUS (in, see Gen_Ai_Kbd-Main[5C]), I2C_SDA_BUS (bidir, see Gen_Ai_Kbd-Main[5C]), JSTCK_LEFT_CLICK (out, see Gen_Ai_Kbd-Main[5C]), JSTCK_LEFT_X (out, see Gen_Ai_Kbd-Main[5C]), JSTCK_LEFT_Y (out, see Gen_Ai_Kbd-Main[5C]), JSTCK_RIGHT_CLICK (out, see Gen_Ai_Kbd-Main[5C]), JSTCK_RIGHT_X (out, see Gen_Ai_Kbd-Main[5C]), JSTCK_RIGHT_Y (out, see Gen_Ai_Kbd-Main[5C]), LOGO_PWM_B (in, see Gen_Ai_Kbd-Main[5C]), LOGO_PWM_G (in, see Gen_Ai_Kbd-Main[5C]), LOGO_PWM_R (in, see Gen_Ai_Kbd-Main[5C]), POT_SL_LEFT (out, see Gen_Ai_Kbd-Main[5C]), POT_SL_LEFT_LED (in, see Gen_Ai_Kbd-Main[5C]), POT_SL_RIGHT (out, see Gen_Ai_Kbd-Main[5C]), POT_SL_RIGHT_LED (in, see Gen_Ai_Kbd-Main[5C]), VIB_MOT_LEFT (in, see Gen_Ai_Kbd-Main[5C]), VIB_MOT_RIGHT (in, see Gen_Ai_Kbd-Main[5C])

### Nets
+3V3_GLOBAL_BUS: D19.1(A) D20.1(A) FB19.1 FB21.1 FB23.1 VR1.1(CW) VR2.1(CW) ; port +3V3_PER
GND: C51.2 C52.2 C53.2 C54.2 C55.1 C56.1 C59.1 C60.1 C70.1 C71.2 C72.2 P6.1 Q3.2(S) Q4.2(S) R3.1(MNT_1) R3.2(MNT_2) R3.3(MNT_3) R3.3_VR1(3_VR1) R3.3_VR2(3_VR2) R3.4(MNT_4) R3.b R3.d R4.1(MNT_1) R4.2(MNT_2) R4.3(MNT_3) R4.3_VR1(3_VR1) R4.3_VR2(3_VR2) R4.4(MNT_4) R4.b R4.d R22.2 R23.2 R29.2 U12.A2(RSVD4) U12.A6(RSVD1) U12.A7(RSVD2) U12.B4(PAD) U12.C1(GND) U12.C6(RSVD3) U12.C7(GND) U23.1(A0) U23.2(A1) U23.4(VSS) U23.7(WP) VR1.3(CCW) VR1.E(CCW) VR2.3(CCW) VR2.E(CCW)
I2C1_SCL: R30.1 ; port I2C_SCL_BUS
I2C1_SDA: R31.1 ; port I2C_SDA_BUS
PA0: R16.1 R19.1 ; port LOGO_PWM_R
PA1: R15.1 R18.1 ; port LOGO_PWM_G
PA15: R12.1 R17.1 ; port LOGO_PWM_B
PC6: R21.2 ; port VIB_MOT_RIGHT
PC7: R20.2 ; port VIB_MOT_LEFT
NetC51_1: C51.1 R10.2 ; port JSTCK_LEFT_X
NetC52_1: C52.1 R11.2 ; port JSTCK_LEFT_Y
NetC53_1: C53.1 R13.2 ; port JSTCK_RIGHT_X
NetC54_1: C54.1 R14.2 ; port JSTCK_RIGHT_Y
NetC55_2: C55.2 FB19.2 FB20.1
NetC56_2: C56.2 FB21.2 FB22.1
NetC57_1: C57.1 D21.1(C) FB20.2 J6.1 R4.1_VR1(1_VR1) R4.1_VR2(1_VR2)
NetC57_2: C57.2 D21.2(A) J6.2 Q3.3(D)
NetC58_1: C58.1 C70.2 D22.1(C) FB22.2 J7.1 P6.2 R3.1_VR1(1_VR1) R3.1_VR2(1_VR2) U23.3(A2) U23.8(VCC)
NetC58_2: C58.2 D22.2(A) J7.2 Q4.3(D)
NetC59_2: C59.2 C60.2 FB23.2 R24.1 R25.1 R26.1 R27.1 R28.1 U12.A4(IOVDD) U12.B1(AVDD) U12.B7(AVDD)
NetC71_1: C71.1 R37.2 ; port POT_SL_LEFT
NetC72_1: C72.1 R39.2 ; port POT_SL_RIGHT
NetD19_2: D19.2(K) R12.2
NetD19_3: D19.3(K) R15.2
NetD19_4: D19.4(K) R16.2
NetD20_2: D20.2(K) R17.2
NetD20_3: D20.3(K) R18.2
NetD20_4: D20.4(K) R19.2
NetMD1_7: R3.a R3.c ; port JSTCK_RIGHT_CLICK
NetMD1_26: R4.a R4.c ; port JSTCK_LEFT_CLICK
NetMD1_36: R40.2 ; port POT_SL_RIGHT_LED
NetMD1_37: R38.2 ; port POT_SL_LEFT_LED
NetP6_3: P6.3 R32.1
NetP6_4: P6.4 R33.1
NetQ3_1: Q3.1(G) R20.1 R22.1
NetQ4_1: Q4.1(G) R21.1 R23.1
NetR3_2_VR1: R3.2_VR1(2_VR1) R13.1
NetR3_2_VR2: R3.2_VR2(2_VR2) R14.1
NetR4_2_VR1: R4.2_VR1(2_VR1) R10.1
NetR4_2_VR2: R4.2_VR2(2_VR2) R11.1
NetR24_2: R24.2 U12.A5(LPn)
NetR25_2: R25.2 U12.A3(INT)
NetR26_2: R26.2 R30.2 R33.2 R35.1 U12.C4(SCL)
NetR27_2: R27.2 R31.2 R32.2 R36.1 U12.C3(SDA)
NetR28_2: R28.2 U12.C2(RSVD6)
NetR29_1: R29.1 U12.A1(I2C_RST)
NetR35_2: R35.2 U23.6(SCL)
NetR36_2: R36.2 U23.5(SDA)
NetR37_1: R37.1 VR1.2(S)
NetR38_1: R38.1 VR1.B(CCW)
NetR39_1: R39.1 VR2.2(S)
NetR40_1: R40.1 VR2.B(CCW)

Not connected (* = marked no-connect by the designer): U12 C5(RSVD5)

### Notes on the sheet
- Approximately 15mA to each LED
- THIS DOCUMENT AND THE DATA DISCLOSED HEREIN OR
- HEREWITH IS THE PROPERTY OF SUMASTA TECH AND MAY
- DWG NO:
- REVISION
- REV:
- DESCRIPTION
- DATE
- APPROVED
- BE FREELY DISTRIBUTED IN WHOLE. NO RIGHTS ARE
- THIS DOCUMENT IS SUBJECT TO CHANGE WITHOUT NOTICE
- RESERVED OR EXPRESS OR IMPLIED WARANTEE GIVEN.
- PROJECT
- sumasta
- t
- PROJECT REVISION:
- TITLE
- DOCUMENT REVISION:
- DESIGN ITEM:
- SCALE:
- A3
- SIZE
- CAGE CODE
- FILE NAME
- DWG NO.
- SHEET
- OF
- REV

### Library data of the parts
C51-C54 C57-C59 C70-C72 = CMP-007-000655-1: WCAP-CSGP Multilayer Ceramic Chip Capacitor, General Purpose, size 0603, X7R, 100nF, 50VDC; Manufacturer: Wurth Elektronik; Capacitance Tolerance: +/-10%; Insulation Resistance: 5GO; Case/Size Code: 0603; Technical Reference: X7R0603104K050DFCT10000; Dissipation Factor: 3%; Operating Temperature Max: 125°C; Category: Multilayer Ceramic Chip Capacitors; ComponentLink1Description: Website Link; Manufacturer Part Number: 885012206095; Pin Count: 2; Ceramic Type: X7R; Component Type: Standard; Mount: Surface Mount; Operating Temperature Min: -55°C; Source: WCAP-CSGP.SchLib; ComponentLink2URL: https://www.we-online.com/redexpert/spec/885012206095?ad; Packaging: Tape and Reel; Match Code: WCAP-CSGP; Width: 0.8mm; ComponentLink1URL: https://www.we-online.com/redexpert/article/885012206095?ad; Height: 0.8mm; Design Item ID: 885012206095; Length: 1.6mm; ComponentLink2Description: Datasheet Link
C55 C56 = CMP-03913-53914760-1: 885012206051 Cap Cer 0.68UF 16V X7R 0603; Insulation Resistance: 700MΩ; Tolerance: 10%; Capacitance: 680nF; NexarPartId: 53914760; Dielectric: X7R; Max Operating Temperature: 125°C; Thickness: 939.8µm; Case Code (Imperial): 0603; Length: 1.6mm; RoHS: Compliant; Min Operating Temperature: -55°C; Width: 800µm; Mount: Surface Mount; Height: 800µm; Case/Package: 0603; Case Code (Metric): 1608; Voltage Rating (DC): 16V; Packaging: Tape & Reel (TR); Voltage Rating: 16V
C60 = CMP-007-000403-1: WCAP-CSGP Multilayer Ceramic Chip Capacitor, General Purpose, size 0603, X5R, 10µF, 6.3VDC; Manufacturer: Wurth Elektronik; Rated Voltage (DC): 6.3V; Insulation Resistance: 0.01GO; Technical Reference: X5R0603106M6R3DFCT10000; Dissipation Factor: 10%; Case/Size Code: 0603; Capacitance Tolerance: +/-20%; Mount: Surface Mount; Packaging: Tape and Reel; ComponentLink1URL: https://www.we-online.com/redexpert/article/885012106006?ad; Height: 0.8mm; ComponentLink2URL: https://www.we-online.com/redexpert/spec/885012106006?ad; Category: Multilayer Ceramic Chip Capacitors; Operating Temperature Max: 85°C; Operating Temperature Min: -55°C; Source: WCAP-CSGP.SchLib; Match Code: WCAP-CSGP; Design Item ID: 885012106006; Ceramic Type: X5R; Manufacturer Part Number: 885012106006; Component Type: Standard; Pin Count: 2; Width: 0.8mm; ComponentLink2Description: Datasheet Link; ComponentLink1Description: Website Link; Length: 1.6mm
D19 D20 = CMP-03913-133884675-1: 155124M172400 Wl-sfsw SMT Full-color Side View; NexarPartId: 133884675
D21 D22 = CMP-07163-000040-1: DIODE GEN PURP 75V 150MA SOD323F; Forward Voltage: 1V; Power Dissipation: 200mW; Element Configuration: Single; Max Forward Surge Current (Ifsm): 2A; Peak Reverse Current: 5uA; Recovery Time: 4ns; Package Quantity: 1; Number of Pins: 2; Height: 1mm; REACH SVHC: No SVHC; Max Reverse Voltage (DC): 75V; Forward Current: 150mA; Length: 1.8mm; Max Repetitive Reverse Voltage (Vrrm): 75V; Max Operating Temperature: 150°C; Average Rectified Current: 150mA; Contact Plating: Tin; Packaging: Tape and Reel; Radiation Hardening: No; Min Operating Temperature: -55°C; Width: 1.35mm; Weight: 0.0276g; Lead Free: Lead Free; Mount: Surface Mount; Reverse Voltage: 75V; Reverse Recovery Time: 4ns
FB19-FB23 = CMP-0220-00181-3: NexarPartId: 7864500; RMS Current (Irms): 1A; Number of Lines: 1; Test Frequency: 100MHz; Impedance: 600Ω; Inductance: 360mH; Resistance: 200mΩ; Tolerance: 25%; Case Code (Imperial): 0603; Lead Free: Lead Free; Current Rating: 1A; Height: 800µm; Min Operating Temperature: -55°C; Core Material: Ferrite; REACH SVHC: Unknown; Case/Package: 0603; Weight: 3.997283mg; Mount: Surface Mount; Termination: SMD/SMT; Case Code (Metric): 1608; DC Resistance (DCR): 200mΩ; Series Resistance: 200mΩ; Max Operating Temperature: 125°C; Width: 800µm; Length: 1.6mm; Max DC Current: 1A; RoHS: Compliant; Material: Ferrite; Max Current Rating: 1A; Depth: 800µm; Packaging: Cut Tape (CT)
J6 J7 = CMP-1502-01405-2: NexarPartId: 61924709; Gender: Female; Current Rating: 3A; Contact Resistance: 20mΩ; Operating Supply Voltage: 250V; RoHS: Non-Compliant; Number of Pins: 2; Lead Pitch: 2.54mm
P6 = CMP-1502-01064-2: NexarPartId: 32855522; Pitch: 2.54mm; Number of Contacts: 4; Contact Resistance: 20mΩ; Gender: Male; Current Rating: 3A; Connector Type: Male Pin; Voltage Rating: 250V; Lead Free: Lead Free; Contact Plating: Gold; Max Operating Temperature: 105°C; Packaging: Bulk; Height: 8.89mm; Orientation: Vertical; Contact Mating Length: 5.9944mm; Contact Material: Copper; Lead Pitch: 2.54mm; Min Operating Temperature: -40°C; Termination: Solder; Color: Black; Number of Rows: 1; REACH SVHC: Unknown; RoHS: Compliant; Mount: Through Hole; Number of Positions: 4; Number of Pins: 4; Operating Supply Voltage: 250V
Q3 Q4 = CMP-12801-000017-1: MOSFET N-CH 100V 170MA SOT23-3; Manufacturer: Diodes Incorporated; Standoff Height: 0.013mm; Power Dissipation: 300mW; Gate To Source Voltage: 20V; Transconductance: 0.37S; Pulse Drain Current: 680mA; Max Forward Diode Voltage: 1.3V; Input Capacitace At Vds: 22pF @ 25V; Number Of N Channels: 1; Threshold Vgs Min: 0.8V; Threshold Vgs Max: 2V; Turn On Delay Time: 8ns; Depletion Mode: False; Typ Forward Diode Voltage: 0.84V; Drain To Source Resistance: 6Ω; Max Junction Temp: +150°C; Rthja Max: 417°C/W; Turn Off Delay Time: 13ns; Automotive Grade: NA; Lead Free: Yes; Manufacturer Part Number: BSS123-7-F; Device Class L1: Discrete Semiconductors; Footprint Url: https://www.diodes.com/assets/Package-Files/SOT23.pdf; Automotive: No; ComponentLink2Description: Datasheet; Octopart: https://octopart.com/bss123-7-f-diodes+inc.-335886; Mouser Description: MOSFET 100V 360mW; RoHS: TRUE; Temperature Range Low: -55°C; Number Of Channels: 1; Device Class L3: MOSFETs; Temperature Range High: +150°C; Drain To Source Breakdown Voltage: 100V; Package: SOT23; Temperature: -55°C to +150°C; Continuous Drain Current: 170mA; Category: Trans; Drain To Source Voltage: 100V; ComponentLink2URL: https://www.diodes.com/assets/Datasheets/ds30366.pdf; Height: 1.1mm; Digikey Description: MOSFET N-CH 100V 170MA SOT23-3; Device Class L2: Transistors
R3 R4 = CMP-24118-000005-1: Res POT 10K Ohm 0.0125W (25.4 X 20.7 X 19.3mm) Pin Bracket Mount/Through Hole Tray; Insulation Resistance: 100MR; Resistance: 10kR; Power Rating: 12.5mW; Current Rating: 50mA; Life (Hours): 100Hour; Type: Potentiometer; Mount: Through Hole; Series: RKJXV/ RKJXK; Packaging: Tray; Radiation Hardening: No; Resistor Type: Potentiometer; Termination: Pin; Height: 12.9mm; Military Standard: Not; Min Operating Temperature: -10°C; Max Operating Temperature: 70°C; Package Quantity: 1000; Contact Current Rating: 50mA; Width: 16mm; Depth: 20.7mm; Length: 16mm; RoHS Compliant: Yes
R10-R33 R35-R40 = CMP-009-00017-5: Chip Resistor, 10 KOhm, +/- 1%, 01 W, -55 to 155 degC, 0603 (1608 Metric); Voltage Rating: 50V; Power: 100mW; RoHS Compliant: True; Min Operating Temperature: -55°C; Pins: 2; Case/Package: 0603; Mounting Technology: SM; Max Operating Temperature: 155°C; Tolerance: 1%
U12 = CMP-003-000011-1: VL53L5CX - 8X8 Segment, Light, 3D Time-of-Flight _ToF_ Sensor Evaluation Board
U23 = CMP-0159-00567-1: 1 Mbit, 400kHz, 2.5V, I2C Serial EEPROM, 8-Pin SOIC 208mil, Industrial Temperature; PackageDescription: 8-Lead Plastic Small Outline (SM) - Medium, 5.28 mm Body [SOIJ]; PackageReference: SOIJ-SM8; DatasheetVersion: revF, Oct-2008; PackageVersion: revBB, Aug-2009
VR1 VR2 = CMP-009-00177-1: Linear Trimpot(R) Trimming Potentiometer, 10 KOhm, +/- 10%, 0.5 W, -55 to 125 degC, 3-Pin THD, RoHS, Tube; Manufacturer: Bourns; Resistance: 10k; Tolerance: 20%; Voltage Rating: 300V; Power: 500mW; Packaging: Bulk; RoHS Compliant: Yes; Package Reference: 3296W; Package Description: 3-Pin Through Hole Device, Body 9.53 x 4.83 mm, Pitch 2.54 mm; Max Operating Temperature: 55°C; Case/Package: 3296W; Package Quantity: 600; Manufacturer URL: http://www.bourns.com/; Mounting Technology: Through Hole; Datasheet URL: http://www.bourns.com/docs/Product-Datasheets/3296.pdf; Datasheet Version: May-16; Min Operating Temperature: -10°C